# Altium project HLK_RM60_KIT_V1.1.PrjPcb
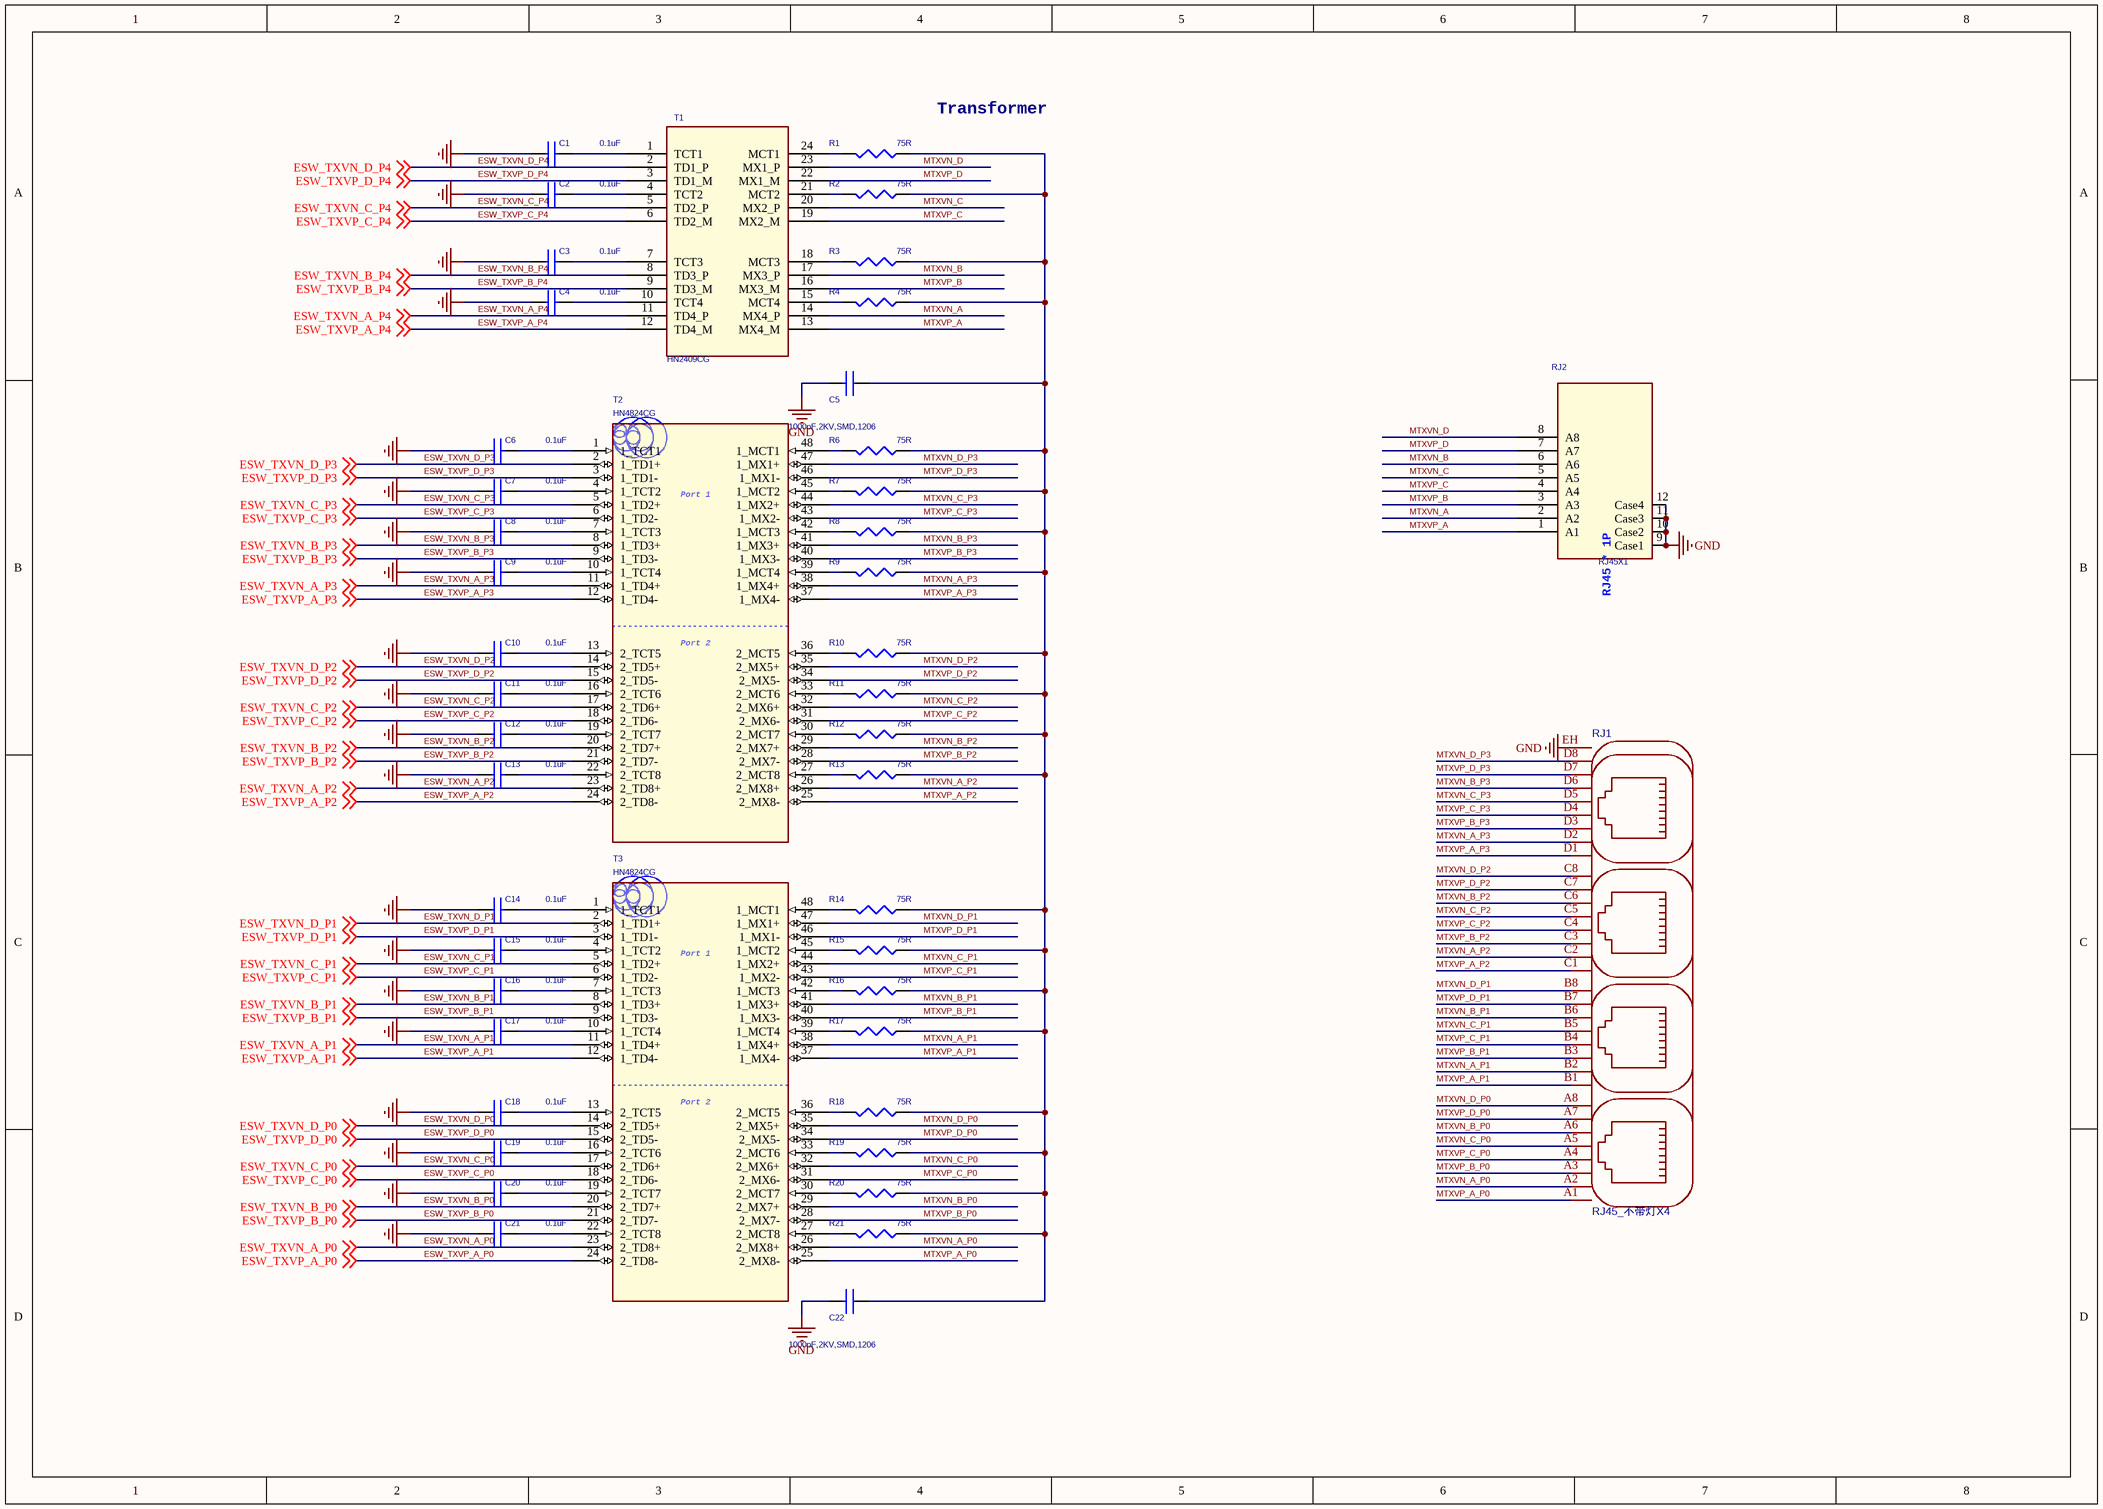
[diagram p0: HLK_RM60_KIT_RJ45_V1.1.SchDoc]
2 sheets, 133 parts. Net scope: flat (ports and power ports of the same name join across sheets).
Board file: HLK_RM60_KIT_V1.1.PcbDoc
Sheets:
  HLK_RM60_KIT_RJ45_V1.1.SchDoc
  HLK_RM60_KIT_V1.1.SchDoc

## Sheet HLK_RM60_KIT_RJ45_V1.1.SchDoc
size A3

### Parts
C1  0.1uF  [C0402]
C2  0.1uF  [C0402]
C3  0.1uF  [C0402]
C4  0.1uF  [C0402]
C5  1000pF,2KV,SMD,1206  [C1206]
C6  0.1uF  [C0402]
C7  0.1uF  [C0402]
C8  0.1uF  [C0402]
C9  0.1uF  [C0402]
C10  0.1uF  [C0402]
C11  0.1uF  [C0402]
C12  0.1uF  [C0402]
C13  0.1uF  [C0402]
C14  0.1uF  [C0402]
C15  0.1uF  [C0402]
C16  0.1uF  [C0402]
C17  0.1uF  [C0402]
C18  0.1uF  [C0402]
C19  0.1uF  [C0402]
C20  0.1uF  [C0402]
C21  0.1uF  [C0402]
C22  1000pF,2KV,SMD,1206  [C1206]
R1  75R  [R0402]
R2  75R  [R0402]
R3  75R  [R0402]
R4  75R  [R0402]
R6  75R  [R0402]
R7  75R  [R0402]
R8  75R  [R0402]
R9  75R  [R0402]
R10  75R  [R0402]
R11  75R  [R0402]
R12  75R  [R0402]
R13  75R  [R0402]
R14  75R  [R0402]
R15  75R  [R0402]
R16  75R  [R0402]
R17  75R  [R0402]
R18  75R  [R0402]
R19  75R  [R0402]
R20  75R  [R0402]
R21  75R  [R0402]
RJ1  RJ45_不带灯X4  [RJ45_网口不带灯X4]
RJ2  RJ45X1  [RJ45_网口不带灯X1]
T1  HN2409CG  [TRANSFORMER/24P/SMD/HN2429CG]
T2  HN4824CG  [TRANSFORMER/48P/SMD/GS5014LF]
T3  HN4824CG  [TRANSFORMER/48P/SMD/GS5014LF]

### Nets
GND: C1.1 C2.1 C3.1 C4.1 C5.2 C6.1 C7.1 C8.1 C9.1 C10.1 C11.1 C12.1 C13.1 C14.1 C15.1 C16.1 C17.1 C18.1 C19.1 C20.1 C21.1 C22.2 RJ1.EH RJ2.9(Case1) RJ2.10(Case2) RJ2.11(Case3) RJ2.12(Case4)
ESW_TXVN_A_P0: T3.23(2_TD8+) ; off-sheet ESW_TXVN_A_P0
ESW_TXVN_A_P1: T3.11(1_TD4+) ; off-sheet ESW_TXVN_A_P1
ESW_TXVN_A_P2: T2.23(2_TD8+) ; off-sheet ESW_TXVN_A_P2
ESW_TXVN_A_P3: T2.11(1_TD4+) ; off-sheet ESW_TXVN_A_P3
ESW_TXVN_A_P4: T1.11(TD4_P) ; off-sheet ESW_TXVN_A_P4
ESW_TXVN_B_P0: T3.20(2_TD7+) ; off-sheet ESW_TXVN_B_P0
ESW_TXVN_B_P1: T3.8(1_TD3+) ; off-sheet ESW_TXVN_B_P1
ESW_TXVN_B_P2: T2.20(2_TD7+) ; off-sheet ESW_TXVN_B_P2
ESW_TXVN_B_P3: T2.8(1_TD3+) ; off-sheet ESW_TXVN_B_P3
ESW_TXVN_B_P4: T1.8(TD3_P) ; off-sheet ESW_TXVN_B_P4
ESW_TXVN_C_P0: T3.17(2_TD6+) ; off-sheet ESW_TXVN_C_P0
ESW_TXVN_C_P1: T3.5(1_TD2+) ; off-sheet ESW_TXVN_C_P1
ESW_TXVN_C_P2: T2.17(2_TD6+) ; off-sheet ESW_TXVN_C_P2
ESW_TXVN_C_P3: T2.5(1_TD2+) ; off-sheet ESW_TXVN_C_P3
ESW_TXVN_C_P4: T1.5(TD2_P) ; off-sheet ESW_TXVN_C_P4
ESW_TXVN_D_P0: T3.14(2_TD5+) ; off-sheet ESW_TXVN_D_P0
ESW_TXVN_D_P1: T3.2(1_TD1+) ; off-sheet ESW_TXVN_D_P1
ESW_TXVN_D_P2: T2.14(2_TD5+) ; off-sheet ESW_TXVN_D_P2
ESW_TXVN_D_P3: T2.2(1_TD1+) ; off-sheet ESW_TXVN_D_P3
ESW_TXVN_D_P4: T1.2(TD1_P) ; off-sheet ESW_TXVN_D_P4
ESW_TXVP_A_P0: T3.24(2_TD8-) ; off-sheet ESW_TXVP_A_P0
ESW_TXVP_A_P1: T3.12(1_TD4-) ; off-sheet ESW_TXVP_A_P1
ESW_TXVP_A_P2: T2.24(2_TD8-) ; off-sheet ESW_TXVP_A_P2
ESW_TXVP_A_P3: T2.12(1_TD4-) ; off-sheet ESW_TXVP_A_P3
ESW_TXVP_A_P4: T1.12(TD4_M) ; off-sheet ESW_TXVP_A_P4
ESW_TXVP_B_P0: T3.21(2_TD7-) ; off-sheet ESW_TXVP_B_P0
ESW_TXVP_B_P1: T3.9(1_TD3-) ; off-sheet ESW_TXVP_B_P1
ESW_TXVP_B_P2: T2.21(2_TD7-) ; off-sheet ESW_TXVP_B_P2
ESW_TXVP_B_P3: T2.9(1_TD3-) ; off-sheet ESW_TXVP_B_P3
ESW_TXVP_B_P4: T1.9(TD3_M) ; off-sheet ESW_TXVP_B_P4
ESW_TXVP_C_P0: T3.18(2_TD6-) ; off-sheet ESW_TXVP_C_P0
ESW_TXVP_C_P1: T3.6(1_TD2-) ; off-sheet ESW_TXVP_C_P1
ESW_TXVP_C_P2: T2.18(2_TD6-) ; off-sheet ESW_TXVP_C_P2
ESW_TXVP_C_P3: T2.6(1_TD2-) ; off-sheet ESW_TXVP_C_P3
ESW_TXVP_C_P4: T1.6(TD2_M) ; off-sheet ESW_TXVP_C_P4
ESW_TXVP_D_P0: T3.15(2_TD5-) ; off-sheet ESW_TXVP_D_P0
ESW_TXVP_D_P1: T3.3(1_TD1-) ; off-sheet ESW_TXVP_D_P1
ESW_TXVP_D_P2: T2.15(2_TD5-) ; off-sheet ESW_TXVP_D_P2
ESW_TXVP_D_P3: T2.3(1_TD1-) ; off-sheet ESW_TXVP_D_P3
ESW_TXVP_D_P4: T1.3(TD1_M) ; off-sheet ESW_TXVP_D_P4
MTXVN_A: RJ2.2(A2) T1.14(MX4_P)
MTXVN_A_P0: RJ1.A2 T3.26(2_MX8+)
MTXVN_A_P1: RJ1.B2 T3.38(1_MX4+)
MTXVN_A_P2: RJ1.C2 T2.26(2_MX8+)
MTXVN_A_P3: RJ1.D2 T2.38(1_MX4+)
MTXVN_B: RJ2.6(A6) T1.17(MX3_P)
MTXVN_B_P0: RJ1.A6 T3.29(2_MX7+)
MTXVN_B_P1: RJ1.B6 T3.41(1_MX3+)
MTXVN_B_P2: RJ1.C6 T2.29(2_MX7+)
MTXVN_B_P3: RJ1.D6 T2.41(1_MX3+)
MTXVN_C: RJ2.5(A5) T1.20(MX2_P)
MTXVN_C_P0: RJ1.A5 T3.32(2_MX6+)
MTXVN_C_P1: RJ1.B5 T3.44(1_MX2+)
MTXVN_C_P2: RJ1.C5 T2.32(2_MX6+)
MTXVN_C_P3: RJ1.D5 T2.44(1_MX2+)
MTXVN_D: RJ2.8(A8) T1.23(MX1_P)
MTXVN_D_P0: RJ1.A8 T3.35(2_MX5+)
MTXVN_D_P1: RJ1.B8 T3.47(1_MX1+)
MTXVN_D_P2: RJ1.C8 T2.35(2_MX5+)
MTXVN_D_P3: RJ1.D8 T2.47(1_MX1+)
MTXVP_A: RJ2.1(A1) T1.13(MX4_M)
MTXVP_A_P0: RJ1.A1 T3.25(2_MX8-)
MTXVP_A_P1: RJ1.B1 T3.37(1_MX4-)
MTXVP_A_P2: RJ1.C1 T2.25(2_MX8-)
MTXVP_A_P3: RJ1.D1 T2.37(1_MX4-)
MTXVP_B: RJ2.3(A3) T1.16(MX3_M)
MTXVP_B_P0: RJ1.A3 T3.28(2_MX7-)
MTXVP_B_P1: RJ1.B3 T3.40(1_MX3-)
MTXVP_B_P2: RJ1.C3 T2.28(2_MX7-)
MTXVP_B_P3: RJ1.D3 T2.40(1_MX3-)
MTXVP_C: RJ2.4(A4) T1.19(MX2_M)
MTXVP_C_P0: RJ1.A4 T3.31(2_MX6-)
MTXVP_C_P1: RJ1.B4 T3.43(1_MX2-)
MTXVP_C_P2: RJ1.C4 T2.31(2_MX6-)
MTXVP_C_P3: RJ1.D4 T2.43(1_MX2-)
MTXVP_D: RJ2.7(A7) T1.22(MX1_M)
MTXVP_D_P0: RJ1.A7 T3.34(2_MX5-)
MTXVP_D_P1: RJ1.B7 T3.46(1_MX1-)
MTXVP_D_P2: RJ1.C7 T2.34(2_MX5-)
MTXVP_D_P3: RJ1.D7 T2.46(1_MX1-)
NetC1_2: C1.2 T1.1(TCT1)
NetC2_2: C2.2 T1.4(TCT2)
NetC3_2: C3.2 T1.7(TCT3)
NetC4_2: C4.2 T1.10(TCT4)
NetC5_1: C5.1 C22.1 R1.1 R2.1 R3.1 R4.1 R6.1 R7.1 R8.1 R9.1 R10.1 R11.1 R12.1 R13.1 R14.1 R15.1 R16.1 R17.1 R18.1 R19.1 R20.1 R21.1
NetC6_2: C6.2 T2.1(1_TCT1)
NetC7_2: C7.2 T2.4(1_TCT2)
NetC8_2: C8.2 T2.7(1_TCT3)
NetC9_2: C9.2 T2.10(1_TCT4)
NetC10_2: C10.2 T2.13(2_TCT5)
NetC11_2: C11.2 T2.16(2_TCT6)
NetC12_2: C12.2 T2.19(2_TCT7)
NetC13_2: C13.2 T2.22(2_TCT8)
NetC14_2: C14.2 T3.1(1_TCT1)
NetC15_2: C15.2 T3.4(1_TCT2)
NetC16_2: C16.2 T3.7(1_TCT3)
NetC17_2: C17.2 T3.10(1_TCT4)
NetC18_2: C18.2 T3.13(2_TCT5)
NetC19_2: C19.2 T3.16(2_TCT6)
NetC20_2: C20.2 T3.19(2_TCT7)
NetC21_2: C21.2 T3.22(2_TCT8)
NetR1_2: R1.2 T1.24(MCT1)
NetR2_2: R2.2 T1.21(MCT2)
NetR3_2: R3.2 T1.18(MCT3)
NetR4_2: R4.2 T1.15(MCT4)
NetR6_2: R6.2 T2.48(1_MCT1)
NetR7_2: R7.2 T2.45(1_MCT2)
NetR8_2: R8.2 T2.42(1_MCT3)
NetR9_2: R9.2 T2.39(1_MCT4)
NetR10_2: R10.2 T2.36(2_MCT5)
NetR11_2: R11.2 T2.33(2_MCT6)
NetR12_2: R12.2 T2.30(2_MCT7)
NetR13_2: R13.2 T2.27(2_MCT8)
NetR14_2: R14.2 T3.48(1_MCT1)
NetR15_2: R15.2 T3.45(1_MCT2)
NetR16_2: R16.2 T3.42(1_MCT3)
NetR17_2: R17.2 T3.39(1_MCT4)
NetR18_2: R18.2 T3.36(2_MCT5)
NetR19_2: R19.2 T3.33(2_MCT6)
NetR20_2: R20.2 T3.30(2_MCT7)
NetR21_2: R21.2 T3.27(2_MCT8)

### Notes on the sheet
- (near R1) Transformer
- (in symbol RJ45X1_4) RJ45 * 1P
- (in symbol XMER 2P G2PM109N) Port 1; Port 2

### Library data of the parts
C1-C4 C10-C15 C18 C19 = 0.1UF/25V_+80%-20%_CC_S0603: Cap, MLCC, 0402, Y5V, 16V; Manufacturer: 地穝; Part Number: 100-110-03400; V1: 25V +80% -20%; P/N: 26-400-311104; Class: 0C-0402; Key: 3162U-N14-V11-#478; BOM_Class: RJ45; HYP_Type: (C; By: Ralink; Package: SMD; Distributor_FAX: 02-2917-3336~7; Distributor_TEL: 02-2917-3334; Distributor_Mobile: 0939-969-849; Distributor_Name: 糂╭; Distributor: 瓁穨; Package_Type: Reel
C5 C22 = CAP NP_Dup1: Cap, HighVolt, SMD 1206, 2KV; Manufacturer: Arcotromics; Class: 0C-HighVolt; Key: 3162U-N14-V11-#409; BOM_Class: RJ45; HYP_Type: (C; By: Ralink; Price_USD: 0.02; Price: 0.66; Package_Type: 床杆; Package: DIP; Distributor: 窲瓣悔; Distributor_Name: 羘縈; Distributor_Name2: Alven; Distributor_Mobile: 0933-153488; Distributor_TEL: 02-2999-6599 #163; Distributor_FAX: 02-2999-6614
C6-C9 C16 C17 C20 C21 = 0.1UF/25V_+80%-20%_CC_S0603: Cap, MLCC, 0402, Y5V, 16V; Part Number: 100-110-03400; Manufacturer: 地穝; V1: 25V +80% -20%; P/N: 26-400-311104; By: Ralink; HYP_Type: (C; BOM_Class: RJ45; Key: 3162U-N14-V11-#478; Class: 0C-0402; Package: SMD; Package_Type: Reel; Distributor: 瓁穨; Distributor_Name: 糂╭; Distributor_Mobile: 0939-969-849; Distributor_TEL: 02-2917-3334; Distributor_FAX: 02-2917-3336~7
R1 R2 = R75_1%_S0603: Resistor, 0402, 5%; Manufacturer: 驾м; Part Number: 110-110-03300; V1: 1% 1/16W; P/N: 21-201-627501; SDTSourceLibName: C:\WINDOWS\TEMP\DEVICE1.LIB; HYP_Type: (R; BOM_Class: RJ45; By: Ralink; Key: 3162U-N14-V11-#345; Class: 1R-0402; Package: SMD; Distributor_FAX: 03-3245183 ,3247410; Distributor_TEL: 03-3246169 #2221; Distributor_Name2: Cherry Yang; Distributor_Name: 法睶骸; Distributor: 驾м; Price: 0.0099; Package_Type: Reel; Price_USD: 0.0003; Distributor_Mobile: NA
R3 = R75_1%_S0603: Resistor, 0402, 5%; Manufacturer: 驾м; Part Number: 110-110-03300; V1: 1% 1/16W; P/N: 21-201-627501; SDTSourceLibName: C:\WINDOWS\TEMP\DEVICE1.LIB; By: Ralink; BOM_Class: RJ45; HYP_Type: (R; Key: 3162U-N14-V11-#345; Class: 1R-0402; Package: SMD; Distributor_FAX: 03-3245183 ,3247410; Distributor_TEL: 03-3246169 #2221; Distributor_Name2: Cherry Yang; Distributor_Name: 法睶骸; Distributor: 驾м; Package_Type: Reel; Price: 0.0099; Price_USD: 0.0003; Distributor_Mobile: NA
R4 = R75_1%_S0603: Resistor, 0402, 5%; Part Number: 110-110-03300; Manufacturer: 驾м; V1: 1% 1/16W; P/N: 21-201-627501; SDTSourceLibName: C:\WINDOWS\TEMP\DEVICE1.LIB; Class: 1R-0402; Key: 3162U-N14-V11-#345; HYP_Type: (R; BOM_Class: RJ45; By: Ralink; Package: SMD; Distributor_Mobile: NA; Price_USD: 0.0003; Price: 0.0099; Package_Type: Reel; Distributor: 驾м; Distributor_Name: 法睶骸; Distributor_Name2: Cherry Yang; Distributor_TEL: 03-3246169 #2221; Distributor_FAX: 03-3245183 ,3247410
R6 R9 R12 R17-R19 R21 = R75_1%_S0603: Resistor, SMD 0402, 5%; Manufacturer: 驾м; Part Number: 110-110-03300; V1: 5% 1/4W; P/N: 21-201-627501; SDTSourceLibName: C:\WINDOWS\TEMP\SCH.LIB; By: Ralink; BOM_Class: RJ45; HYP_Type: (R; Key: 3162U-N14-V11-#345; Class: 1R-0402; Package: SMD; Distributor_FAX: 03-3245183 ,3247410; Distributor_TEL: 03-3246169 #2221; Distributor_Name2: Cherry Yang; Distributor_Name: 法睶骸; Distributor: 驾м; Package_Type: Reel; Distributor_Mobile: NA
R7 R8 R10 R11 R13-R16 R20 = R75_1%_S0603: Resistor, SMD 0402, 5%; Part Number: 110-110-03300; Manufacturer: 驾м; V1: 5% 1/4W; P/N: 21-201-627501; SDTSourceLibName: C:\WINDOWS\TEMP\SCH.LIB; Class: 1R-0402; Key: 3162U-N14-V11-#345; HYP_Type: (R; BOM_Class: RJ45; By: Ralink; Package: SMD; Distributor_Mobile: NA; Package_Type: Reel; Distributor: 驾м; Distributor_Name: 法睶骸; Distributor_Name2: Cherry Yang; Distributor_TEL: 03-3246169 #2221; Distributor_FAX: 03-3245183 ,3247410
RJ1 = RJ45_不带灯X4: BOM_Manufacturer: CONNFLY; BOM_Manufacturer Part: DS1129-02-S80BP; subpart_no: 3; BOM_Supplier Part: C77852; BOM_Supplier: LCSC; image: http://image.lceda.cn/szlcsc/C77852.jpg; spicePre: R; spiceSymbolName: DS1129-02-S80BP
RJ2 = RJ45X1_4: Manufacturer: 救┹; Manufacturer's Part Number: PJ-A1-BXBH-FDNNN-1; Part Number: 214411*12311105
T1 = FT20-252B_2
T2 T3 = XMER 2P G2PM109N

## Sheet HLK_RM60_KIT_V1.1.SchDoc
size A3
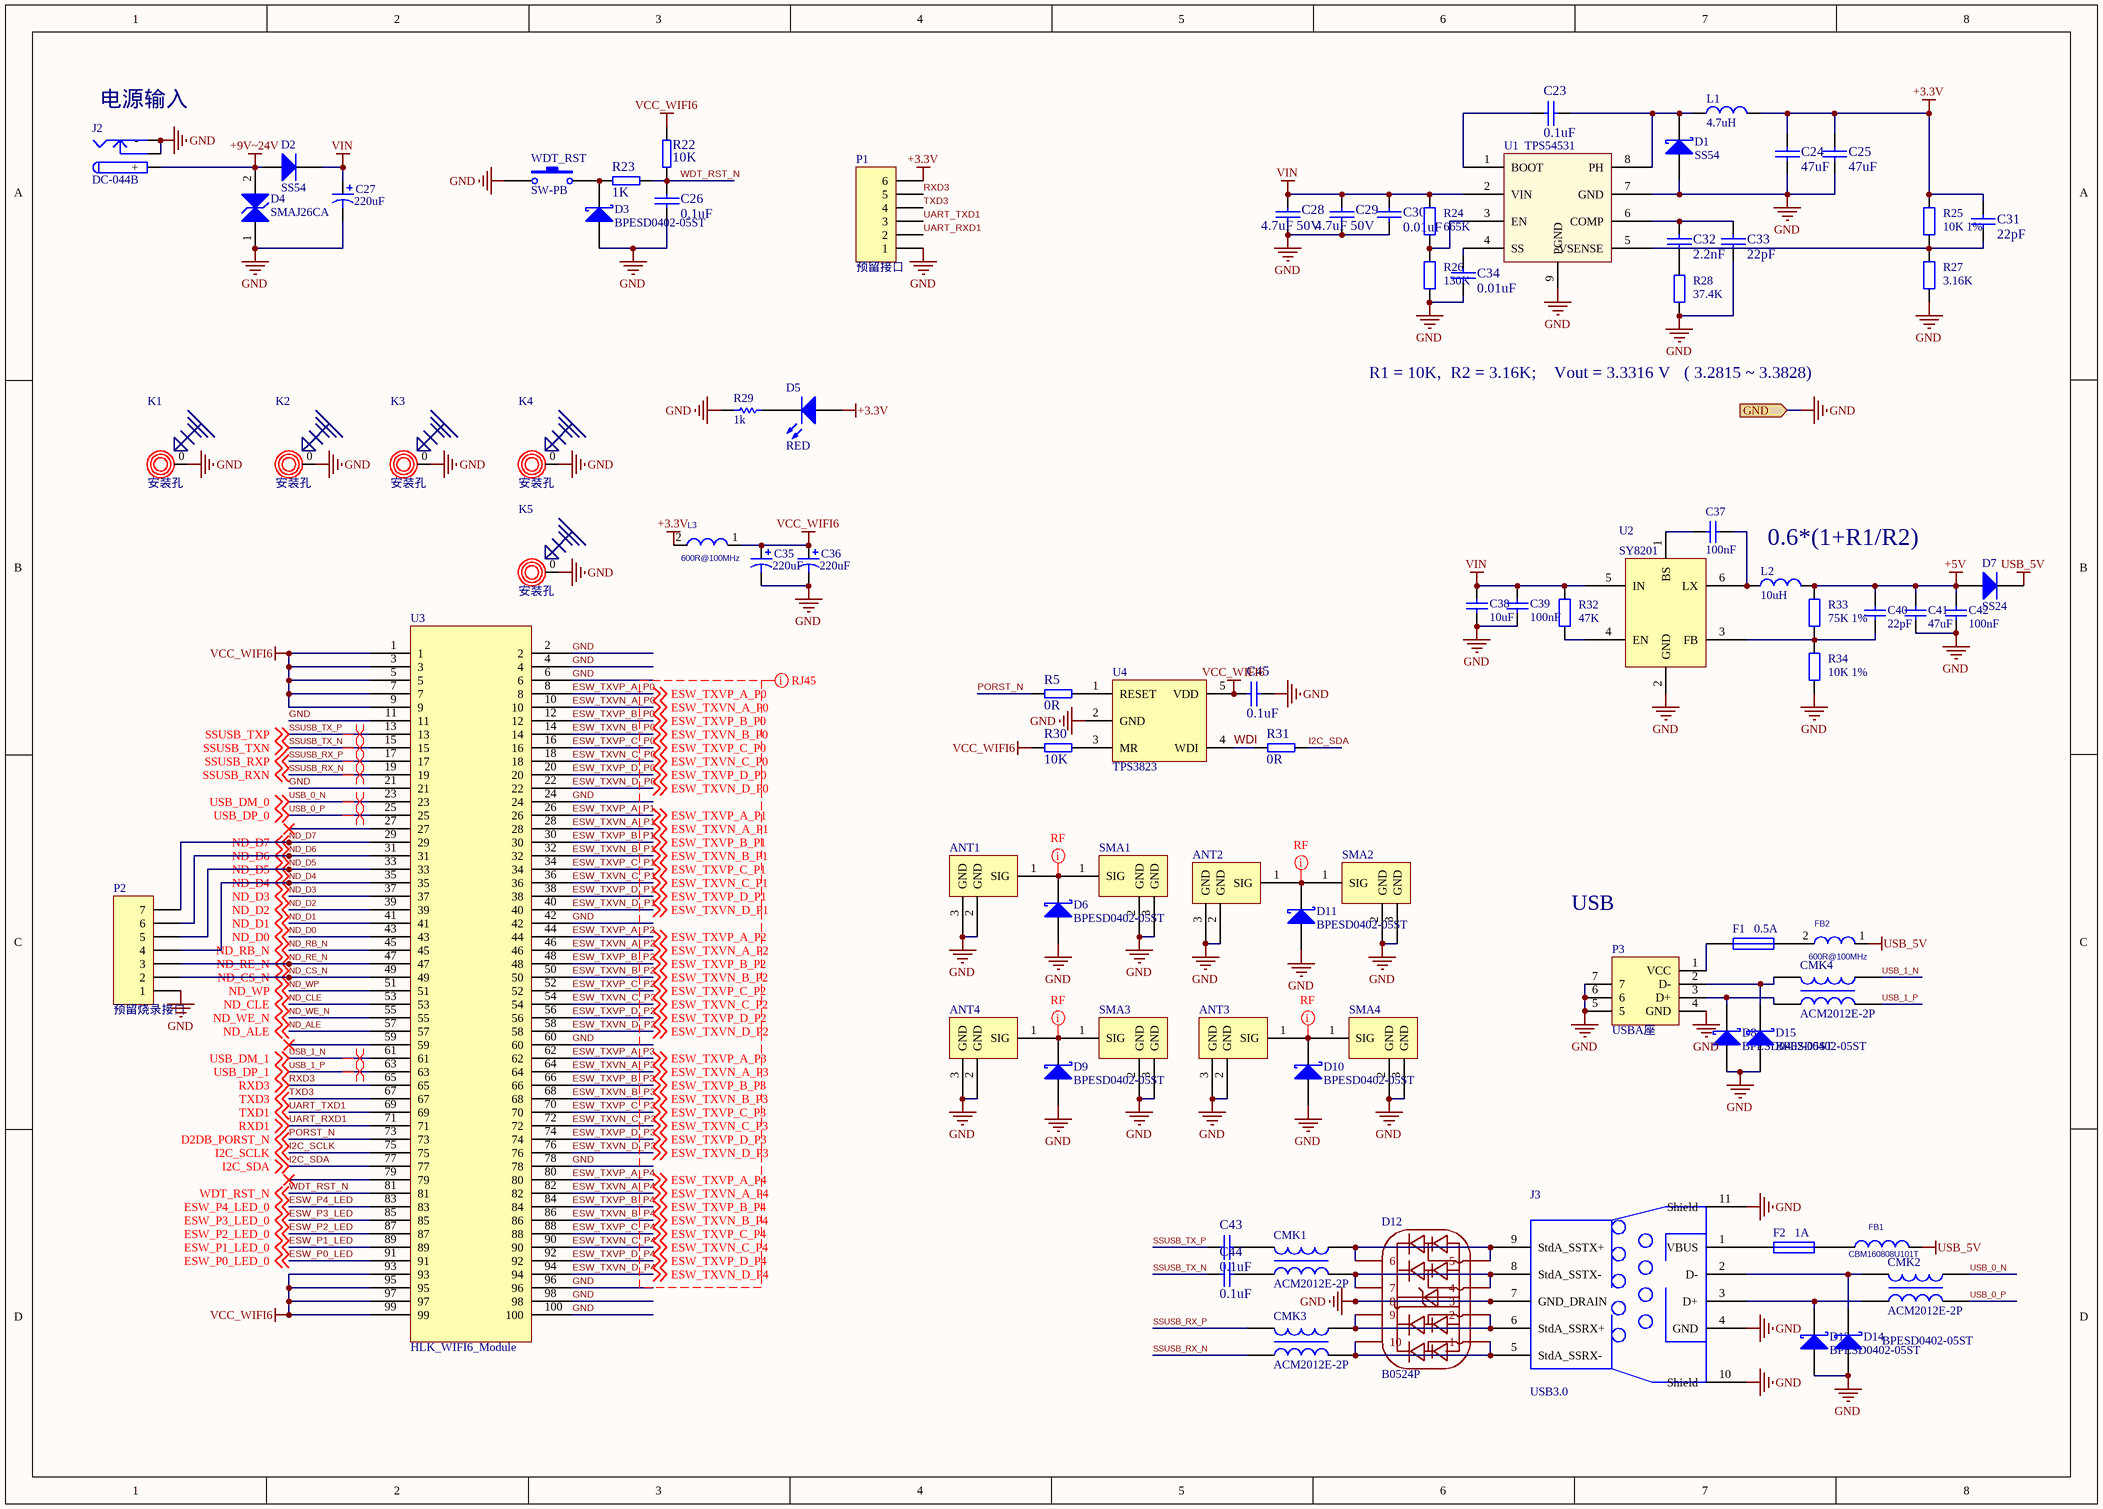
[diagram p1: HLK_RM60_KIT_V1.1.SchDoc]

### Parts
ANT1  u.fl  [U.FL-R-SMT-1]  (value not drawn)
ANT2  u.fl  [U.FL-R-SMT-1]  (value not drawn)
ANT3  u.fl  [U.FL-R-SMT-1]  (value not drawn)
ANT4  u.fl  [U.FL-R-SMT-1]  (value not drawn)
C23  0.1uF  [C0402]
C24  47uF  [CAP_1206]
C25  47uF  [CAP_1206]
C26  0.1uF  [C0402]
C27  value 220uF  [SMD,8x10mm]  (hidden comment: Cap Pol1)
C28  4.7uF 50V  [CAP_1206]
C29  4.7uF 50V  [CAP_1206]
C30  0.01uF  [C0402]
C31  22pF  [C0402]
C32  2.2nF  [C0402]
C33  22pF  [C0402]
C34  0.01uF  [C0402]
C35  value 220uF  [SMD,6.3x7.7mm]  (hidden comment: Cap Pol1)
C36  value 220uF  [SMD,6.3x7.7mm]  (hidden comment: Cap Pol1)
C37  100nF  [C0402]
C38  10uF  [CAP_0805]
C39  100nF  [C0402]
C40  22pF  [C0402]
C41  47uF  [CAP_0805]
C42  100nF  [C0402]
C43  0.1uF  [C0402]
C44  0.1uF  [C0402]
C45  0.1uF  [C0402]
CMK1  ACM2012E-2P  [SMD_4P]
CMK2  ACM2012E-2P  [SMD_4P]
CMK3  ACM2012E-2P  [SMD_4P]
CMK4  ACM2012E-2P  [SMD_4P]
D1  SS54  [LC-SMA(DO-214AC)_S2]
D2  SS54  [SMC]
D3  BPESD0402-05ST  [R0402]
D4  SMAJ26CA  [DO-214AC]
D5  RED  [LED-0603]
D6  BPESD0402-05ST  [RES_0603]
D7  SS24  [LC-SMA(DO-214AC)_S2]
D8  BPESD0402-05ST  [R0402]
D9  BPESD0402-05ST  [RES_0603]
D10  BPESD0402-05ST  [RES_0603]
D11  BPESD0402-05ST  [RES_0603]
D12  B0524P  [DFN-10]
D13  BPESD0402-05ST  [R0402]
D14  BPESD0402-05ST  [R0402]
D15  BPESD0402-05ST  [R0402]
F1  0.5A  [RES_0603]
F2  1A  [RES_0603]
FB1  CBM160808U101T  [CAP_0603]
FB2  600R@100MHz  [CAP_0603]
J2  DC-044B  [DC5.5]
J3  USB3.0  [USB3.0-9P-DIP]
K1  安装孔  [Z_LSK3.5]
K2  安装孔  [Z_LSK3.5]
K3  安装孔  [Z_LSK3.5]
K4  安装孔  [Z_LSK3.5]
K5  安装孔  [Z_LSK3.5]
L1  4.7uH  [L10.8x10x4mm]
L2  10uH  [L4*4]
L3  600R@100MHz  [R1206]
P1  预留接口  [HDR1X6]
P2  预留烧录接口  [HDR1X7]
P3  USBA座  [USBA座侧插]
R5  0R  [R0402]
R22  10K  [R0402]
R23  1K  [R0402]
R24  665K  [R0402]
R25  10K 1%  [R0402]
R26  130K  [R0402]
R27  3.16K  [R0402]
R28  37.4K  [R0402]
R29  1K  [R0402]
R30  10K  [R0402]
R31  0R  [R0402]
R32  47K  [R0402]
R33  75K 1%  [R0402]
R34  10K 1%  [R0402]
SMA1  u.fl  [RF_SMA_夹板1.6mm]  (value not drawn)
SMA2  u.fl  [RF_SMA_夹板1.6mm]  (value not drawn)
SMA3  u.fl  [RF_SMA_夹板1.6mm]  (value not drawn)
SMA4  u.fl  [RF_SMA_夹板1.6mm]  (value not drawn)
U1  TPS54531  [SOP8-MP1484]
U2  SY8201  [SOT26]
U3  HLK_WIFI6_Module  [HLK_WIFI6_Module_SOCKET]
U4  TPS3823  [SOT23-5]
WDT_RST  SW-PB  [6x6x9.85侧按]

### Ports
GND (in)

### Nets
+3.3V: C24.2 C25.2 C31.2 D5.1(A) L1.2 L3.2 P1.6 R25.2
+5V: C40.2 C41.2 C42.1 D7.1(A) L2.2 R33.2
+9V~24V: D2.1(A) D4.2 J2.1(+)
GND: ANT1.2(GND) ANT1.3(GND) ANT2.2(GND) ANT2.3(GND) ANT3.2(GND) ANT3.3(GND) ANT4.2(GND) ANT4.3(GND) C24.1 C25.1 C26.1 C27.2 C28.2 C29.2 C30.1 C33.1 C34.1 C35.2 C36.2 C38.1 C39.2 C41.1 C42.2 C45.1 D1.1(A) D3.1(A) D4.1 D6.1(A) D8.1(A) D9.1(A) D10.1(A) D11.1(A) D12.3 D12.8 D13.1(A) D14.1(A) D15.1(A) J2.2(-) J2.3 J3.4(GND) J3.7(GND_DRAIN) J3.10(Shield) J3.11(Shield) K1.0 K2.0 K3.0 K4.0 K5.0 P1.1 P2.1 P3.4(GND) P3.5 P3.6 P3.7 R26.1 R27.1 R28.1 R29.2 R34.1 SMA1.2(GND) SMA1.3(GND) SMA2.2(GND) SMA2.3(GND) SMA3.2(GND) SMA3.3(GND) SMA4.2(GND) SMA4.3(GND) U1.7(GND) U1.9(PGND) U2.2(GND) U3.2 U3.4 U3.6 U3.11 U3.21 U3.24 U3.42 U3.60 U3.78 U3.96 U3.98 U3.100 U4.2(GND) WDT_RST.1 ; port GND
USB_5V: D7.2(K) FB1.1 FB2.1
VCC_WIFI6: C35.1 C36.1 C45.2 L3.1 R22.1 R30.2 U3.1 U3.3 U3.5 U3.7 U3.9 U3.93 U3.95 U3.97 U3.99 U4.5(VDD)
VIN: C27.1 C28.1 C29.1 C30.2 C38.2 C39.1 D2.2(K) R24.2 R32.2 U1.2(VIN) U2.5(IN)
ESW_P0_LED: U3.91 ; off-sheet ESW_P0_LED_0  [also labelled ESW_P0_LED_0]
ESW_P1_LED: U3.89 ; off-sheet ESW_P1_LED_0  [also labelled ESW_P1_LED_0]
ESW_P2_LED: U3.87 ; off-sheet ESW_P2_LED_0  [also labelled ESW_P2_LED_0]
ESW_P3_LED: U3.85 ; off-sheet ESW_P3_LED_0  [also labelled ESW_P3_LED_0]
ESW_P4_LED: U3.83 ; off-sheet ESW_P4_LED_0  [also labelled ESW_P4_LED_0]
ESW_TXVN_A_P0: U3.10 ; off-sheet ESW_TXVN_A_P0
ESW_TXVN_A_P1: U3.28 ; off-sheet ESW_TXVN_A_P1
ESW_TXVN_A_P2: U3.46 ; off-sheet ESW_TXVN_A_P2
ESW_TXVN_A_P3: U3.64 ; off-sheet ESW_TXVN_A_P3
ESW_TXVN_A_P4: U3.82 ; off-sheet ESW_TXVN_A_P4
ESW_TXVN_B_P0: U3.14 ; off-sheet ESW_TXVN_B_P0
ESW_TXVN_B_P1: U3.32 ; off-sheet ESW_TXVN_B_P1
ESW_TXVN_B_P2: U3.50 ; off-sheet ESW_TXVN_B_P2
ESW_TXVN_B_P3: U3.68 ; off-sheet ESW_TXVN_B_P3
ESW_TXVN_B_P4: U3.86 ; off-sheet ESW_TXVN_B_P4
ESW_TXVN_C_P0: U3.18 ; off-sheet ESW_TXVN_C_P0
ESW_TXVN_C_P1: U3.36 ; off-sheet ESW_TXVN_C_P1
ESW_TXVN_C_P2: U3.54 ; off-sheet ESW_TXVN_C_P2
ESW_TXVN_C_P3: U3.72 ; off-sheet ESW_TXVN_C_P3
ESW_TXVN_C_P4: U3.90 ; off-sheet ESW_TXVN_C_P4
ESW_TXVN_D_P0: U3.22 ; off-sheet ESW_TXVN_D_P0
ESW_TXVN_D_P1: U3.40 ; off-sheet ESW_TXVN_D_P1
ESW_TXVN_D_P2: U3.58 ; off-sheet ESW_TXVN_D_P2
ESW_TXVN_D_P3: U3.76 ; off-sheet ESW_TXVN_D_P3
ESW_TXVN_D_P4: U3.94 ; off-sheet ESW_TXVN_D_P4
ESW_TXVP_A_P0: U3.8 ; off-sheet ESW_TXVP_A_P0
ESW_TXVP_A_P1: U3.26 ; off-sheet ESW_TXVP_A_P1
ESW_TXVP_A_P2: U3.44 ; off-sheet ESW_TXVP_A_P2
ESW_TXVP_A_P3: U3.62 ; off-sheet ESW_TXVP_A_P3
ESW_TXVP_A_P4: U3.80 ; off-sheet ESW_TXVP_A_P4
ESW_TXVP_B_P0: U3.12 ; off-sheet ESW_TXVP_B_P0
ESW_TXVP_B_P1: U3.30 ; off-sheet ESW_TXVP_B_P1
ESW_TXVP_B_P2: U3.48 ; off-sheet ESW_TXVP_B_P2
ESW_TXVP_B_P3: U3.66 ; off-sheet ESW_TXVP_B_P3
ESW_TXVP_B_P4: U3.84 ; off-sheet ESW_TXVP_B_P4
ESW_TXVP_C_P0: U3.16 ; off-sheet ESW_TXVP_C_P0
ESW_TXVP_C_P1: U3.34 ; off-sheet ESW_TXVP_C_P1
ESW_TXVP_C_P2: U3.52 ; off-sheet ESW_TXVP_C_P2
ESW_TXVP_C_P3: U3.70 ; off-sheet ESW_TXVP_C_P3
ESW_TXVP_C_P4: U3.88 ; off-sheet ESW_TXVP_C_P4
ESW_TXVP_D_P0: U3.20 ; off-sheet ESW_TXVP_D_P0
ESW_TXVP_D_P1: U3.38 ; off-sheet ESW_TXVP_D_P1
ESW_TXVP_D_P2: U3.56 ; off-sheet ESW_TXVP_D_P2
ESW_TXVP_D_P3: U3.74 ; off-sheet ESW_TXVP_D_P3
ESW_TXVP_D_P4: U3.92 ; off-sheet ESW_TXVP_D_P4
I2C_SCLK: U3.75 ; off-sheet I2C_SCLK
I2C_SDA: R31.1 U3.77 ; off-sheet I2C_SDA
ND_ALE: U3.57 ; off-sheet ND_ALE
ND_CLE: U3.53 ; off-sheet ND_CLE
ND_CS_N: P2.2 U3.49 ; off-sheet ND_CS_N
ND_D0: U3.43 ; off-sheet ND_D0
ND_D1: U3.41 ; off-sheet ND_D1
ND_D2: U3.39 ; off-sheet ND_D2
ND_D3: U3.37 ; off-sheet ND_D3
ND_D4: P2.4 U3.35 ; off-sheet ND_D4
ND_D5: P2.5 U3.33 ; off-sheet ND_D5
ND_D6: P2.6 U3.31 ; off-sheet ND_D6
ND_D7: P2.7 U3.29 ; off-sheet ND_D7
ND_RB_N: U3.45 ; off-sheet ND_RB_N
ND_RE_N: P2.3 U3.47 ; off-sheet ND_RE_N
ND_WE_N: U3.55 ; off-sheet ND_WE_N
ND_WP: U3.51 ; off-sheet ND_WP
PORST_N: R5.2 U3.73 ; off-sheet D2DB_PORST_N  [also labelled D2DB_PORST_N]
RXD3: P1.5 U3.65 ; off-sheet RXD3
SSUSB_RX_N: CMK3.1 U3.19 ; off-sheet SSUSB_RXN  [also labelled SSUSB_RXN]
SSUSB_RX_P: CMK3.2 U3.17 ; off-sheet SSUSB_RXP  [also labelled SSUSB_RXP]
SSUSB_TX_N: C44.2 U3.15 ; off-sheet SSUSB_TXN  [also labelled SSUSB_TXN]
SSUSB_TX_P: C43.2 U3.13 ; off-sheet SSUSB_TXP  [also labelled SSUSB_TXP]
TXD3: P1.4 U3.67 ; off-sheet TXD3
UART_RXD1: P1.2 U3.71 ; off-sheet RXD1  [also labelled RXD1]
UART_TXD1: P1.3 U3.69 ; off-sheet TXD1  [also labelled TXD1]
USB_0_N: CMK2.3 U3.23 ; off-sheet USB_DM_0  [also labelled USB_DM_0]
USB_0_P: CMK2.4 U3.25 ; off-sheet USB_DP_0  [also labelled USB_DP_0]
USB_1_N: CMK4.3 U3.61 ; off-sheet USB_DM_1  [also labelled USB_DM_1]
USB_1_P: CMK4.4 U3.63 ; off-sheet USB_DP_1  [also labelled USB_DP_1]
WDI: R31.2 U4.4(WDI)
WDT_RST_N: C26.2 R22.2 R23.2 U3.81 ; off-sheet WDT_RST_N
NetANT1_1: ANT1.1(SIG) D6.2(K) SMA1.1(SIG)
NetANT2_1: ANT2.1(SIG) D11.2(K) SMA2.1(SIG)
NetANT3_1: ANT3.1(SIG) D10.2(K) SMA4.1(SIG)
NetANT4_1: ANT4.1(SIG) D9.2(K) SMA3.1(SIG)
NetC23_1: C23.1 D1.2(K) L1.1 U1.8(PH)
NetC23_2: C23.2 U1.1(BOOT)
NetC31_1: C31.1 R25.1 R27.2 U1.5(VSENSE)
NetC32_1: C32.1 R28.2
NetC32_2: C32.2 C33.2 U1.6(COMP)
NetC34_2: C34.2 U1.4(SS)
NetC37_1: C37.1 U2.1(BS)
NetC37_2: C37.2 L2.1 U2.6(LX)
NetC40_1: C40.1 R33.1 R34.2 U2.3(FB)
NetC43_1: C43.1 CMK1.2
NetC44_1: C44.1 CMK1.1
NetCMK1_3: CMK1.3 D12.5 D12.6 J3.9(StdA_SSTX+)
NetCMK1_4: CMK1.4 D12.4 D12.7 J3.8(StdA_SSTX-)
NetCMK2_1: CMK2.1 D13.2(K) J3.3(D+)
NetCMK2_2: CMK2.2 D14.2(K) J3.2(D-)
NetCMK3_3: CMK3.3 D12.2 D12.9 J3.6(StdA_SSRX+)
NetCMK3_4: CMK3.4 D12.1 D12.10 J3.5(StdA_SSRX-)
NetCMK4_1: CMK4.1 D8.2(K) P3.3(D+)
NetCMK4_2: CMK4.2 D15.2(K) P3.2(D-)
NetD3_2: D3.2(K) R23.1 WDT_RST.2
NetD5_2: D5.2(K) R29.1
NetF1_1: F1.1 P3.1(VCC)
NetF1_2: F1.2 FB2.2
NetF2_1: F2.1 J3.1(VBUS)
NetF2_2: F2.2 FB1.2
NetR5_1: R5.1 U4.1(RESET)
NetR24_1: R24.1 R26.2 U1.3(EN)
NetR30_1: R30.1 U4.3(MR)
NetR32_1: R32.1 U2.4(EN)

Not connected (* = marked no-connect by the designer): U3 27* 59* 79*

### Layout directives
net class 100om; rule Clearance Constraint [Clearance = 10mil]: ESW_TXVN_A_P0, ESW_TXVN_A_P1, ESW_TXVN_A_P2, ESW_TXVN_A_P3, ESW_TXVN_A_P4, ESW_TXVN_B_P0, ESW_TXVN_B_P1, ESW_TXVN_B_P2, ESW_TXVN_B_P3, ESW_TXVN_B_P4, ESW_TXVN_C_P0, ESW_TXVN_C_P1, ESW_TXVN_C_P2, ESW_TXVN_C_P3, ESW_TXVN_C_P4, ESW_TXVN_D_P0, ESW_TXVN_D_P1, ESW_TXVN_D_P2, ESW_TXVN_D_P3, ESW_TXVN_D_P4, ESW_TXVP_A_P0, ESW_TXVP_A_P1, ESW_TXVP_A_P2, ESW_TXVP_A_P3, ESW_TXVP_A_P4, ESW_TXVP_B_P0, ESW_TXVP_B_P1, ESW_TXVP_B_P2, ESW_TXVP_B_P3, ESW_TXVP_B_P4, ESW_TXVP_C_P0, ESW_TXVP_C_P1, ESW_TXVP_C_P2, ESW_TXVP_C_P3, ESW_TXVP_C_P4, ESW_TXVP_D_P0, ESW_TXVP_D_P1, ESW_TXVP_D_P2, ESW_TXVP_D_P3, ESW_TXVP_D_P4
differential pair: SSUSB_RX_N, SSUSB_RX_P, SSUSB_TX_N, SSUSB_TX_P, USB_0_N, USB_0_P, USB_1_N, USB_1_P
net class 50om: NetANT1_1, NetANT2_1, NetANT3_1, NetANT4_1

### Notes on the sheet
- (near J2) 电源输入
- R1 = 10K,  R2 = 3.16K;    Vout = 3.3316 V   ( 3.2815 ~ 3.3828)
- 0.6*(1+R1/R2)
- USB

### Library data of the parts
ANT1-ANT4 SMA1-SMA4 = u.fl: SAM天线座
C23-C26 C28-C34 C43-C45 = CAP: Capacitor
C27 C35 C36 = Cap Pol1: Polarized Capacitor (Radial); Published: 8-Jun-2000; LatestRevisionDate: 17-Jul-2002; LatestRevisionNote: Re-released for DXP Platform.; PackageReference: RB7.6-15; Publisher: Altium Limited
C37 C39 C42 = Cap: Capacitor; 物料名称: 贴片电容; 物料编码: 3.01.04.0056
C38 C40 C41 = Cap: Capacitor; Manufacturer: Generic Components; Class: Passive; Value: 100pF; Published: 08/06/2000; Publisher: Altium Hobart Technology Centre; SubClass: Capacitor
CMK1-CMK4 = CMK1
D1 D3 D6 D8-D11 D13-D15 = Diode BAS70: Silicon AF Schottky Diode for High-Speed Switching; Note: Pin 2 is not connected and not drawn.; Published: 21-Mar-2003; DatasheetDocument: Oct-1999; PackageDocument: Sep-2001; PackageReference: SOT-23; Publisher: Altium Limited; ComponentLink1Description: Manufacturer Link; ComponentLink1URL: http://www.infineon.com/; ComponentLink2Description: Datasheet; ComponentLink2URL: http://www.infineon.com/upload/Document/cmc_upload/documents/009/382/bas40_bas140series_1.pdf
D2 D7 = Diode: Default Diode; Published: 8-Jun-2000; LatestRevisionDate: 17-Jul-2002; LatestRevisionNote: Re-released for DXP Platform.; PackageDocument: Sep-1996; PackageReference: SMC; Publisher: Altium Limited; Code_JEDEC: DO-214-AB
D4 = TVS
D5 = LED0: 贴片发光二极管; Published: 8-Jun-2000; LatestRevisionDate: 08-Jul-2005; LatestRevisionNote: Mech Layer 1 removed.; PackageReference: LED-0; Publisher: Altium Limited; PackageDescription: LED; 2 Leads
F1 F2 = Fuse 1: Fuse; Published: 8-Jun-2000; LatestRevisionDate: 17-Jul-2002; LatestRevisionNote: Re-released for DXP Platform.; PackageReference: PIN-W2/E2.8; Publisher: Altium Limited
FB1 = INDUCTOR: MFR_Name: MURATA; MFR_PN: BLM15PX121SZ1D
FB2 L3 = L/0402
J2 = DC-044B: Low Voltage Power Supply Connector; Published: 17-Dec-2003; DatasheetDocument: 09-May-2002; Publisher: Altium Limited; ComponentLink1Description: Manufacturer Link; ComponentLink1URL: http://domino.kycon.com/internet/Products.html
K1-K5 = Z_LSK: 物料名称: 物料名称; 厂家代号: 厂家代号; 品牌: 品牌; 物料编码: 物料编码
L1 L2 = LineInductors: FootPrint: 0805
P1 = Header 6: Header, 6-Pin; LatestRevisionDate: 17-Jul-2002; LatestRevisionNote: Re-released for DXP Platform.; Publisher: Altium Limited
P2 = Header 7: Header, 7-Pin; LatestRevisionDate: 17-Jul-2002; LatestRevisionNote: Re-released for DXP Platform.; Publisher: Altium Limited
R5 R22 R23 R30 R31 = RES2
R24-R28 R32-R34 = Res2: Resistor; Published: 8-Jun-2000; LatestRevisionDate: 17-Jul-2002; LatestRevisionNote: Re-released for DXP Platform.; PackageReference: AXIAL-0.4; Publisher: Altium Limited
  R24: Value: 665K
  R25 R34: Value: 10K 1%
  R26: Value: 130K
  R27: Value: 3.16K
  R28: Value: 37.4K
  R32: Value: 47K
  R33: Value: 75K 1%
R29 = Res1: Resistor; Published: 8-Jun-2000; LatestRevisionDate: 17-Jul-2002; LatestRevisionNote: Re-released for DXP Platform.; PackageReference: AXIAL-0.3; Publisher: Altium Limited; Value: 1k
WDT_RST = SW-PB: Switch; Published: 24-Mar-1999; LatestRevisionDate: 17-Jul-2002; LatestRevisionNote: Re-released for DXP Platform.; PackageReference: SPST-2; Publisher: Altium Limited

## Nets that join several sheets
GND: HLK_RM60_KIT_RJ45_V1.1 (27 pins), HLK_RM60_KIT_V1.1 (84 pins)
ESW_TXVN_A_P0: HLK_RM60_KIT_RJ45_V1.1 (T3.23), HLK_RM60_KIT_V1.1 (U3.10)
ESW_TXVN_A_P1: HLK_RM60_KIT_RJ45_V1.1 (T3.11), HLK_RM60_KIT_V1.1 (U3.28)
ESW_TXVN_A_P2: HLK_RM60_KIT_RJ45_V1.1 (T2.23), HLK_RM60_KIT_V1.1 (U3.46)
ESW_TXVN_A_P3: HLK_RM60_KIT_RJ45_V1.1 (T2.11), HLK_RM60_KIT_V1.1 (U3.64)
ESW_TXVN_A_P4: HLK_RM60_KIT_RJ45_V1.1 (T1.11), HLK_RM60_KIT_V1.1 (U3.82)
ESW_TXVN_B_P0: HLK_RM60_KIT_RJ45_V1.1 (T3.20), HLK_RM60_KIT_V1.1 (U3.14)
ESW_TXVN_B_P1: HLK_RM60_KIT_RJ45_V1.1 (T3.8), HLK_RM60_KIT_V1.1 (U3.32)
ESW_TXVN_B_P2: HLK_RM60_KIT_RJ45_V1.1 (T2.20), HLK_RM60_KIT_V1.1 (U3.50)
ESW_TXVN_B_P3: HLK_RM60_KIT_RJ45_V1.1 (T2.8), HLK_RM60_KIT_V1.1 (U3.68)
ESW_TXVN_B_P4: HLK_RM60_KIT_RJ45_V1.1 (T1.8), HLK_RM60_KIT_V1.1 (U3.86)
ESW_TXVN_C_P0: HLK_RM60_KIT_RJ45_V1.1 (T3.17), HLK_RM60_KIT_V1.1 (U3.18)
ESW_TXVN_C_P1: HLK_RM60_KIT_RJ45_V1.1 (T3.5), HLK_RM60_KIT_V1.1 (U3.36)
ESW_TXVN_C_P2: HLK_RM60_KIT_RJ45_V1.1 (T2.17), HLK_RM60_KIT_V1.1 (U3.54)
ESW_TXVN_C_P3: HLK_RM60_KIT_RJ45_V1.1 (T2.5), HLK_RM60_KIT_V1.1 (U3.72)
ESW_TXVN_C_P4: HLK_RM60_KIT_RJ45_V1.1 (T1.5), HLK_RM60_KIT_V1.1 (U3.90)
ESW_TXVN_D_P0: HLK_RM60_KIT_RJ45_V1.1 (T3.14), HLK_RM60_KIT_V1.1 (U3.22)
ESW_TXVN_D_P1: HLK_RM60_KIT_RJ45_V1.1 (T3.2), HLK_RM60_KIT_V1.1 (U3.40)
ESW_TXVN_D_P2: HLK_RM60_KIT_RJ45_V1.1 (T2.14), HLK_RM60_KIT_V1.1 (U3.58)
ESW_TXVN_D_P3: HLK_RM60_KIT_RJ45_V1.1 (T2.2), HLK_RM60_KIT_V1.1 (U3.76)
ESW_TXVN_D_P4: HLK_RM60_KIT_RJ45_V1.1 (T1.2), HLK_RM60_KIT_V1.1 (U3.94)
ESW_TXVP_A_P0: HLK_RM60_KIT_RJ45_V1.1 (T3.24), HLK_RM60_KIT_V1.1 (U3.8)
ESW_TXVP_A_P1: HLK_RM60_KIT_RJ45_V1.1 (T3.12), HLK_RM60_KIT_V1.1 (U3.26)
ESW_TXVP_A_P2: HLK_RM60_KIT_RJ45_V1.1 (T2.24), HLK_RM60_KIT_V1.1 (U3.44)
ESW_TXVP_A_P3: HLK_RM60_KIT_RJ45_V1.1 (T2.12), HLK_RM60_KIT_V1.1 (U3.62)
ESW_TXVP_A_P4: HLK_RM60_KIT_RJ45_V1.1 (T1.12), HLK_RM60_KIT_V1.1 (U3.80)
ESW_TXVP_B_P0: HLK_RM60_KIT_RJ45_V1.1 (T3.21), HLK_RM60_KIT_V1.1 (U3.12)
ESW_TXVP_B_P1: HLK_RM60_KIT_RJ45_V1.1 (T3.9), HLK_RM60_KIT_V1.1 (U3.30)
ESW_TXVP_B_P2: HLK_RM60_KIT_RJ45_V1.1 (T2.21), HLK_RM60_KIT_V1.1 (U3.48)
ESW_TXVP_B_P3: HLK_RM60_KIT_RJ45_V1.1 (T2.9), HLK_RM60_KIT_V1.1 (U3.66)
ESW_TXVP_B_P4: HLK_RM60_KIT_RJ45_V1.1 (T1.9), HLK_RM60_KIT_V1.1 (U3.84)
ESW_TXVP_C_P0: HLK_RM60_KIT_RJ45_V1.1 (T3.18), HLK_RM60_KIT_V1.1 (U3.16)
ESW_TXVP_C_P1: HLK_RM60_KIT_RJ45_V1.1 (T3.6), HLK_RM60_KIT_V1.1 (U3.34)
ESW_TXVP_C_P2: HLK_RM60_KIT_RJ45_V1.1 (T2.18), HLK_RM60_KIT_V1.1 (U3.52)
ESW_TXVP_C_P3: HLK_RM60_KIT_RJ45_V1.1 (T2.6), HLK_RM60_KIT_V1.1 (U3.70)
ESW_TXVP_C_P4: HLK_RM60_KIT_RJ45_V1.1 (T1.6), HLK_RM60_KIT_V1.1 (U3.88)
ESW_TXVP_D_P0: HLK_RM60_KIT_RJ45_V1.1 (T3.15), HLK_RM60_KIT_V1.1 (U3.20)
ESW_TXVP_D_P1: HLK_RM60_KIT_RJ45_V1.1 (T3.3), HLK_RM60_KIT_V1.1 (U3.38)
ESW_TXVP_D_P2: HLK_RM60_KIT_RJ45_V1.1 (T2.15), HLK_RM60_KIT_V1.1 (U3.56)
ESW_TXVP_D_P3: HLK_RM60_KIT_RJ45_V1.1 (T2.3), HLK_RM60_KIT_V1.1 (U3.74)
ESW_TXVP_D_P4: HLK_RM60_KIT_RJ45_V1.1 (T1.3), HLK_RM60_KIT_V1.1 (U3.92)